# EAGLE schematic scoutfly_rev3 (EAGLE 6.3)
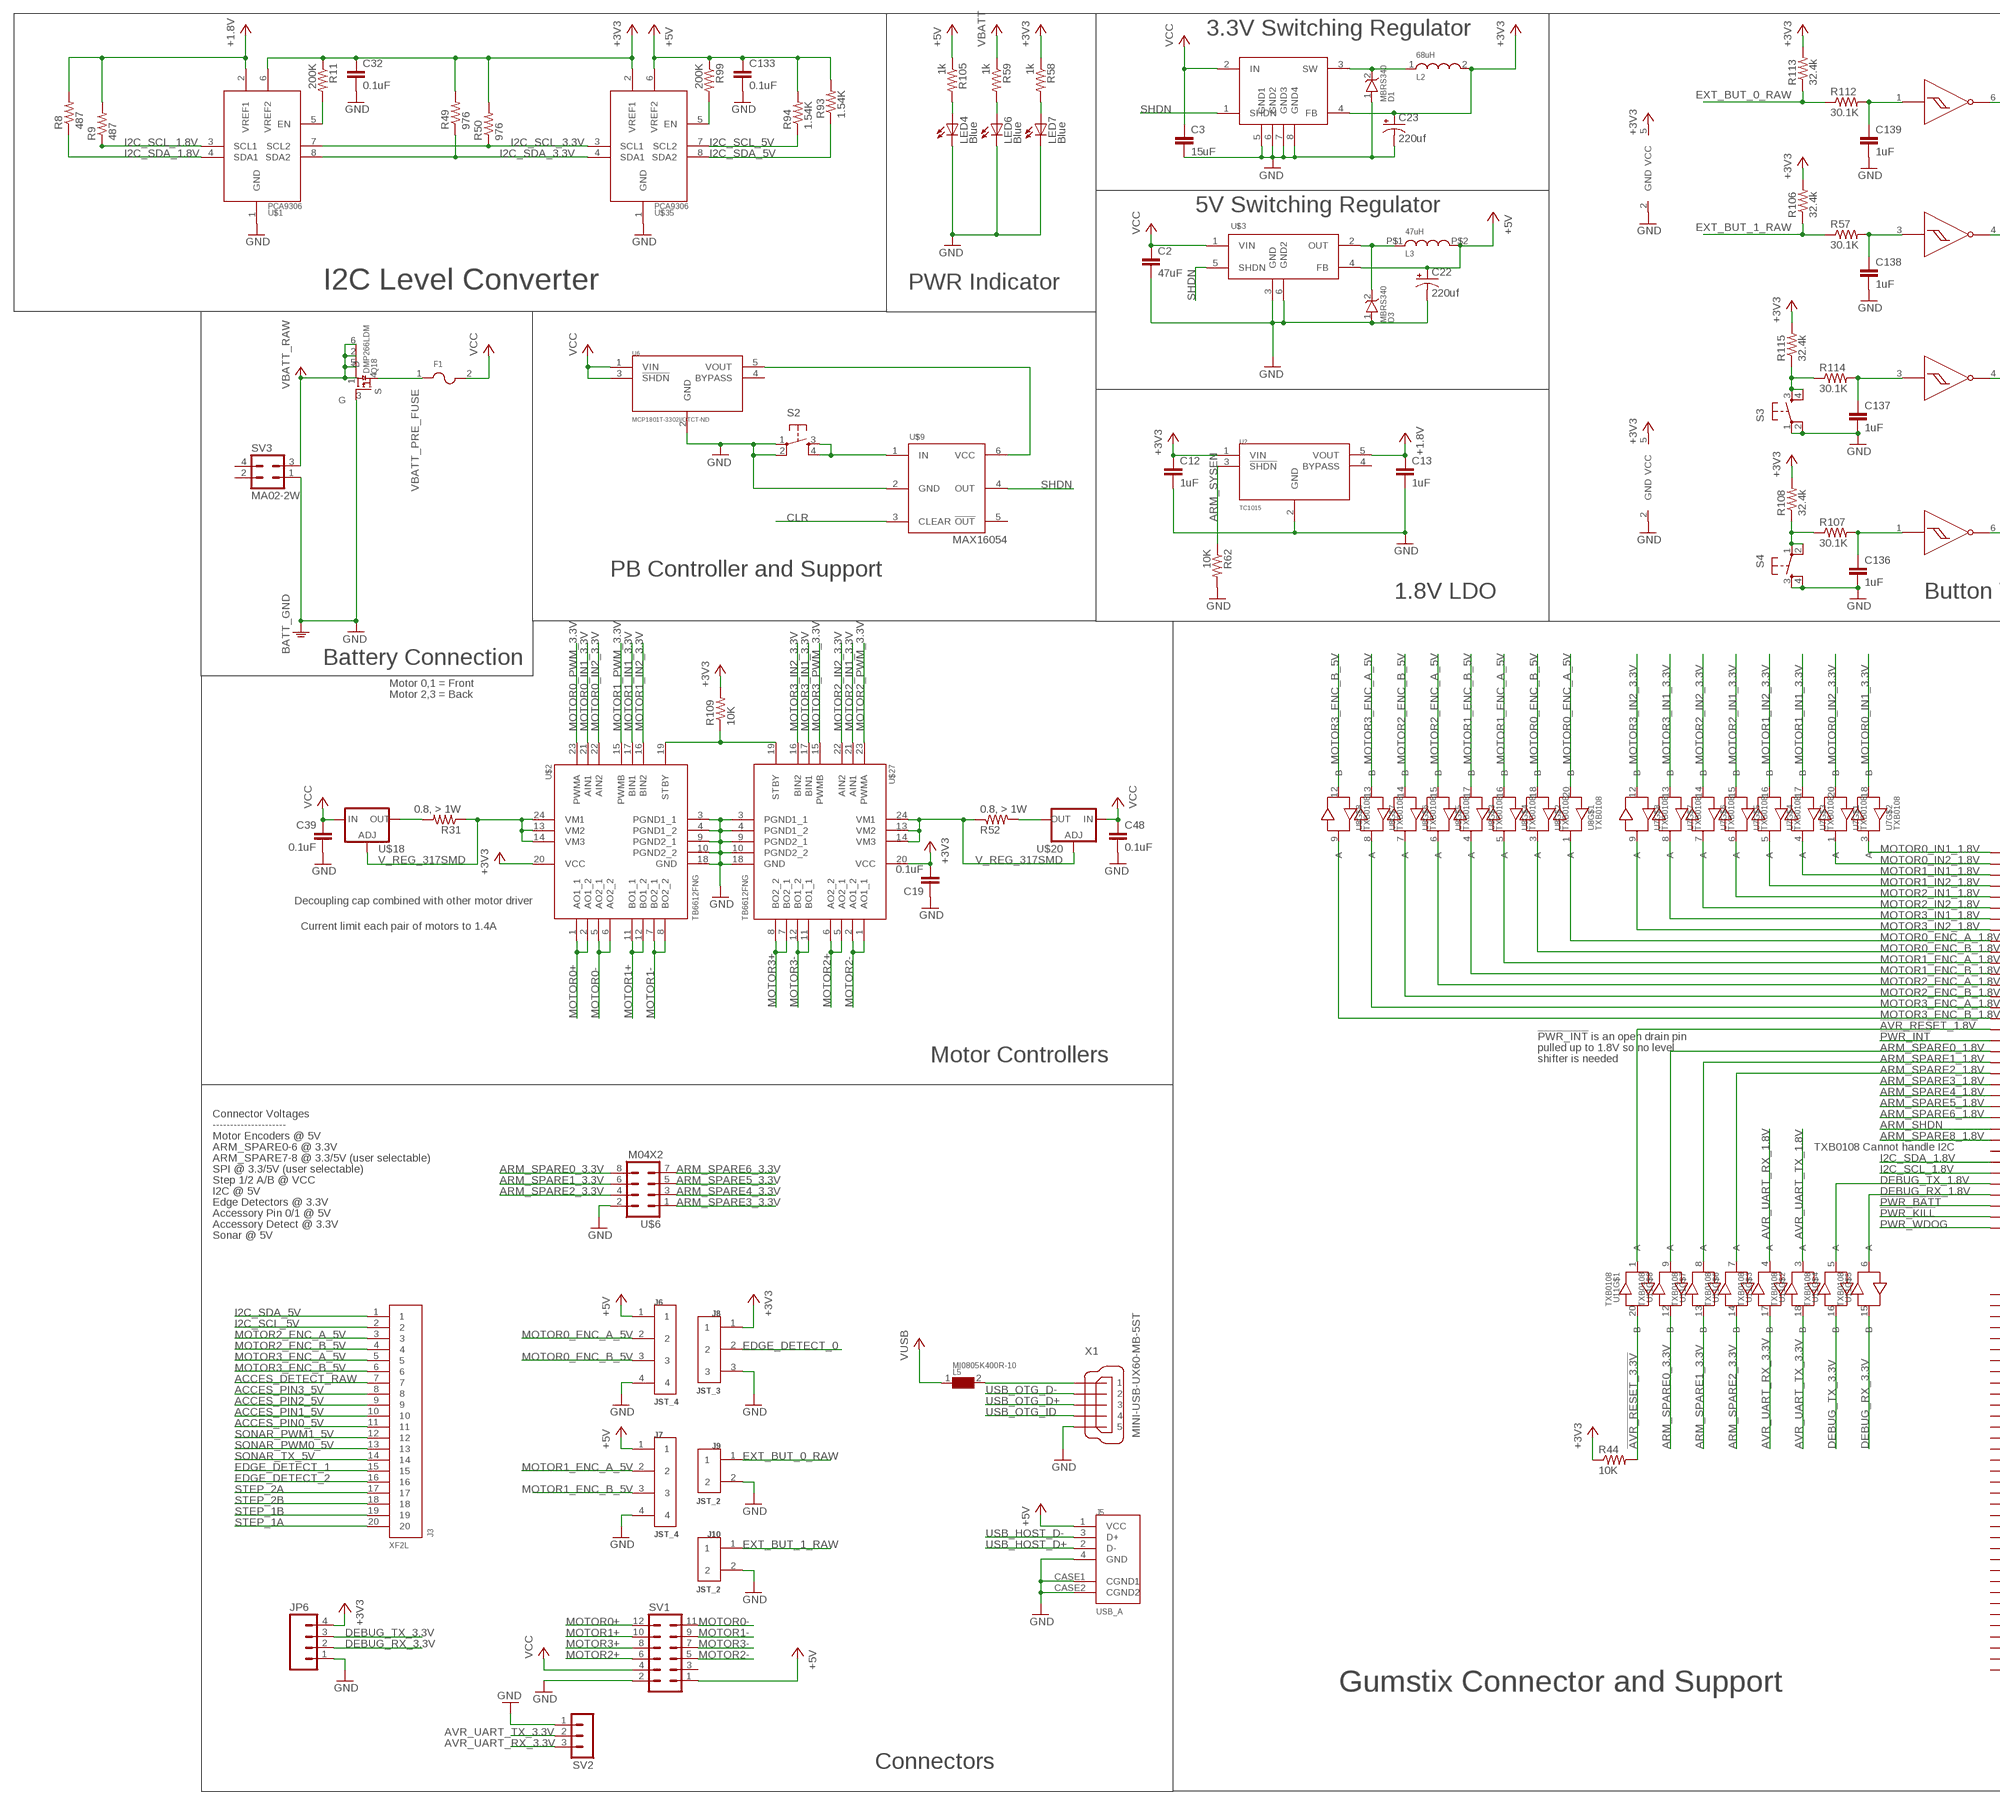
[diagram p0: schematic, sheet 1, part 1 of 3]
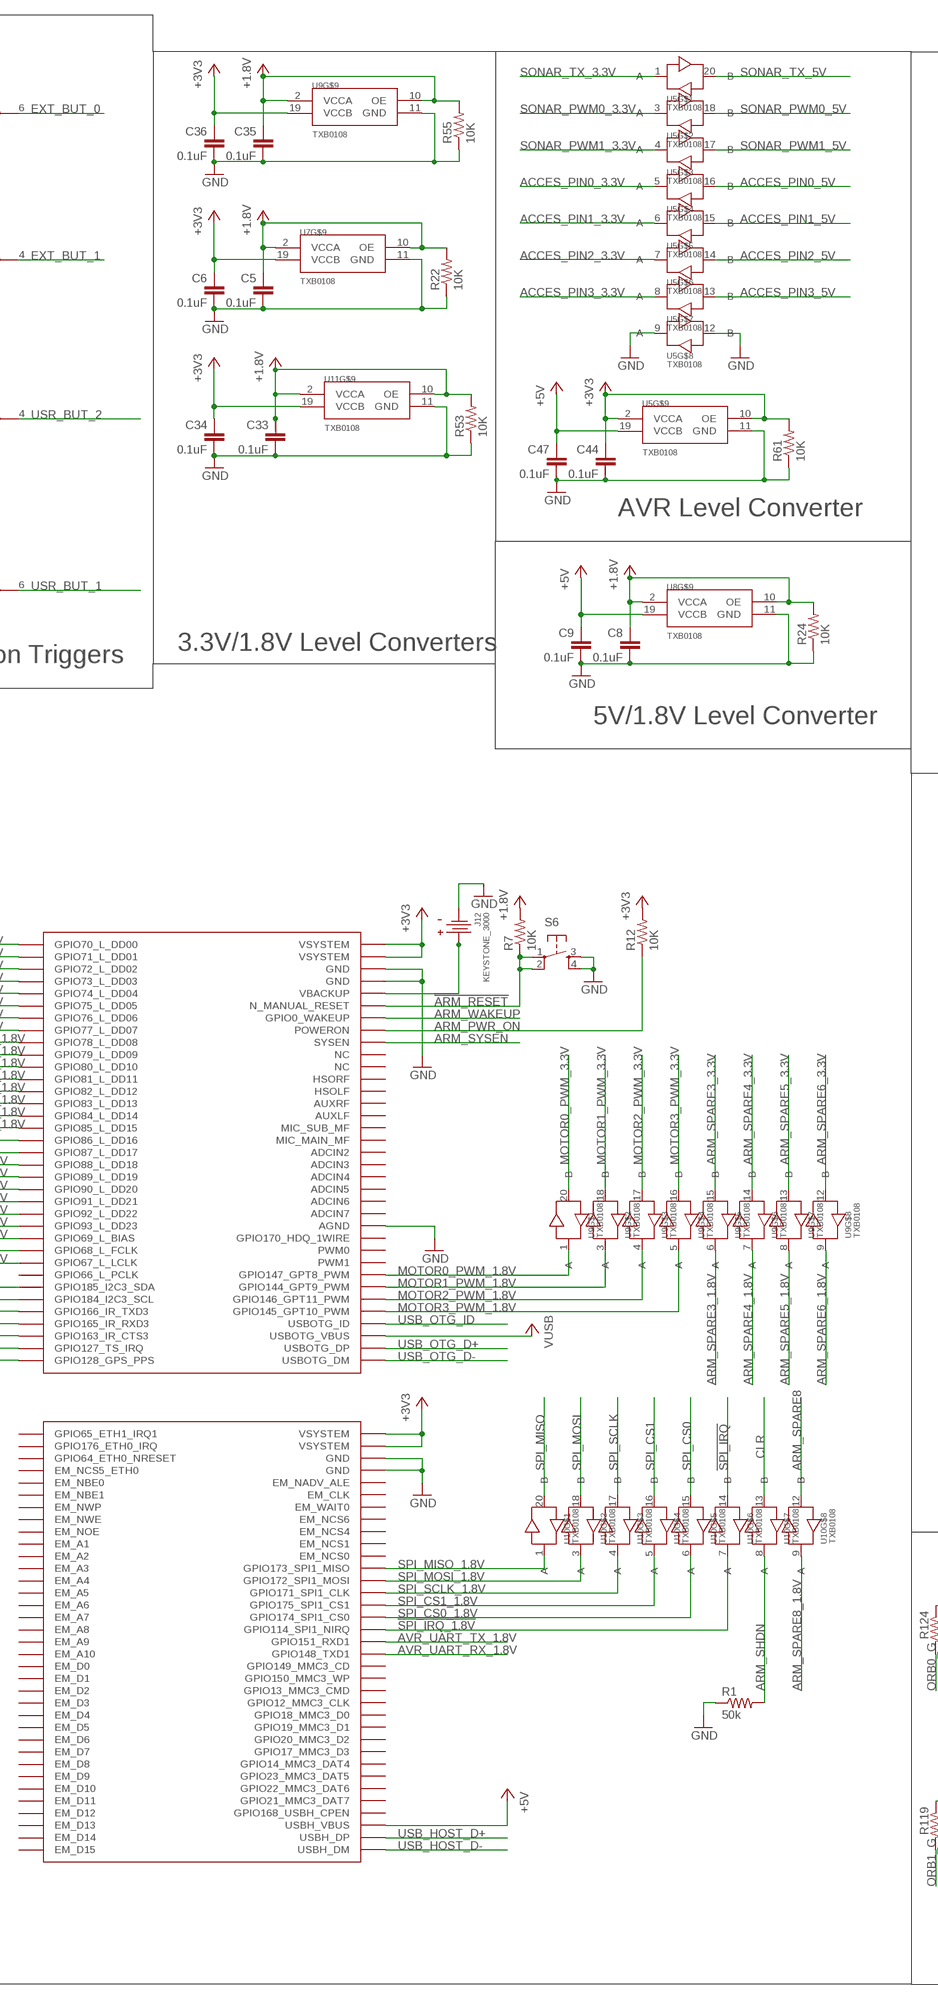
[diagram p1: schematic, sheet 1, part 2 of 3]
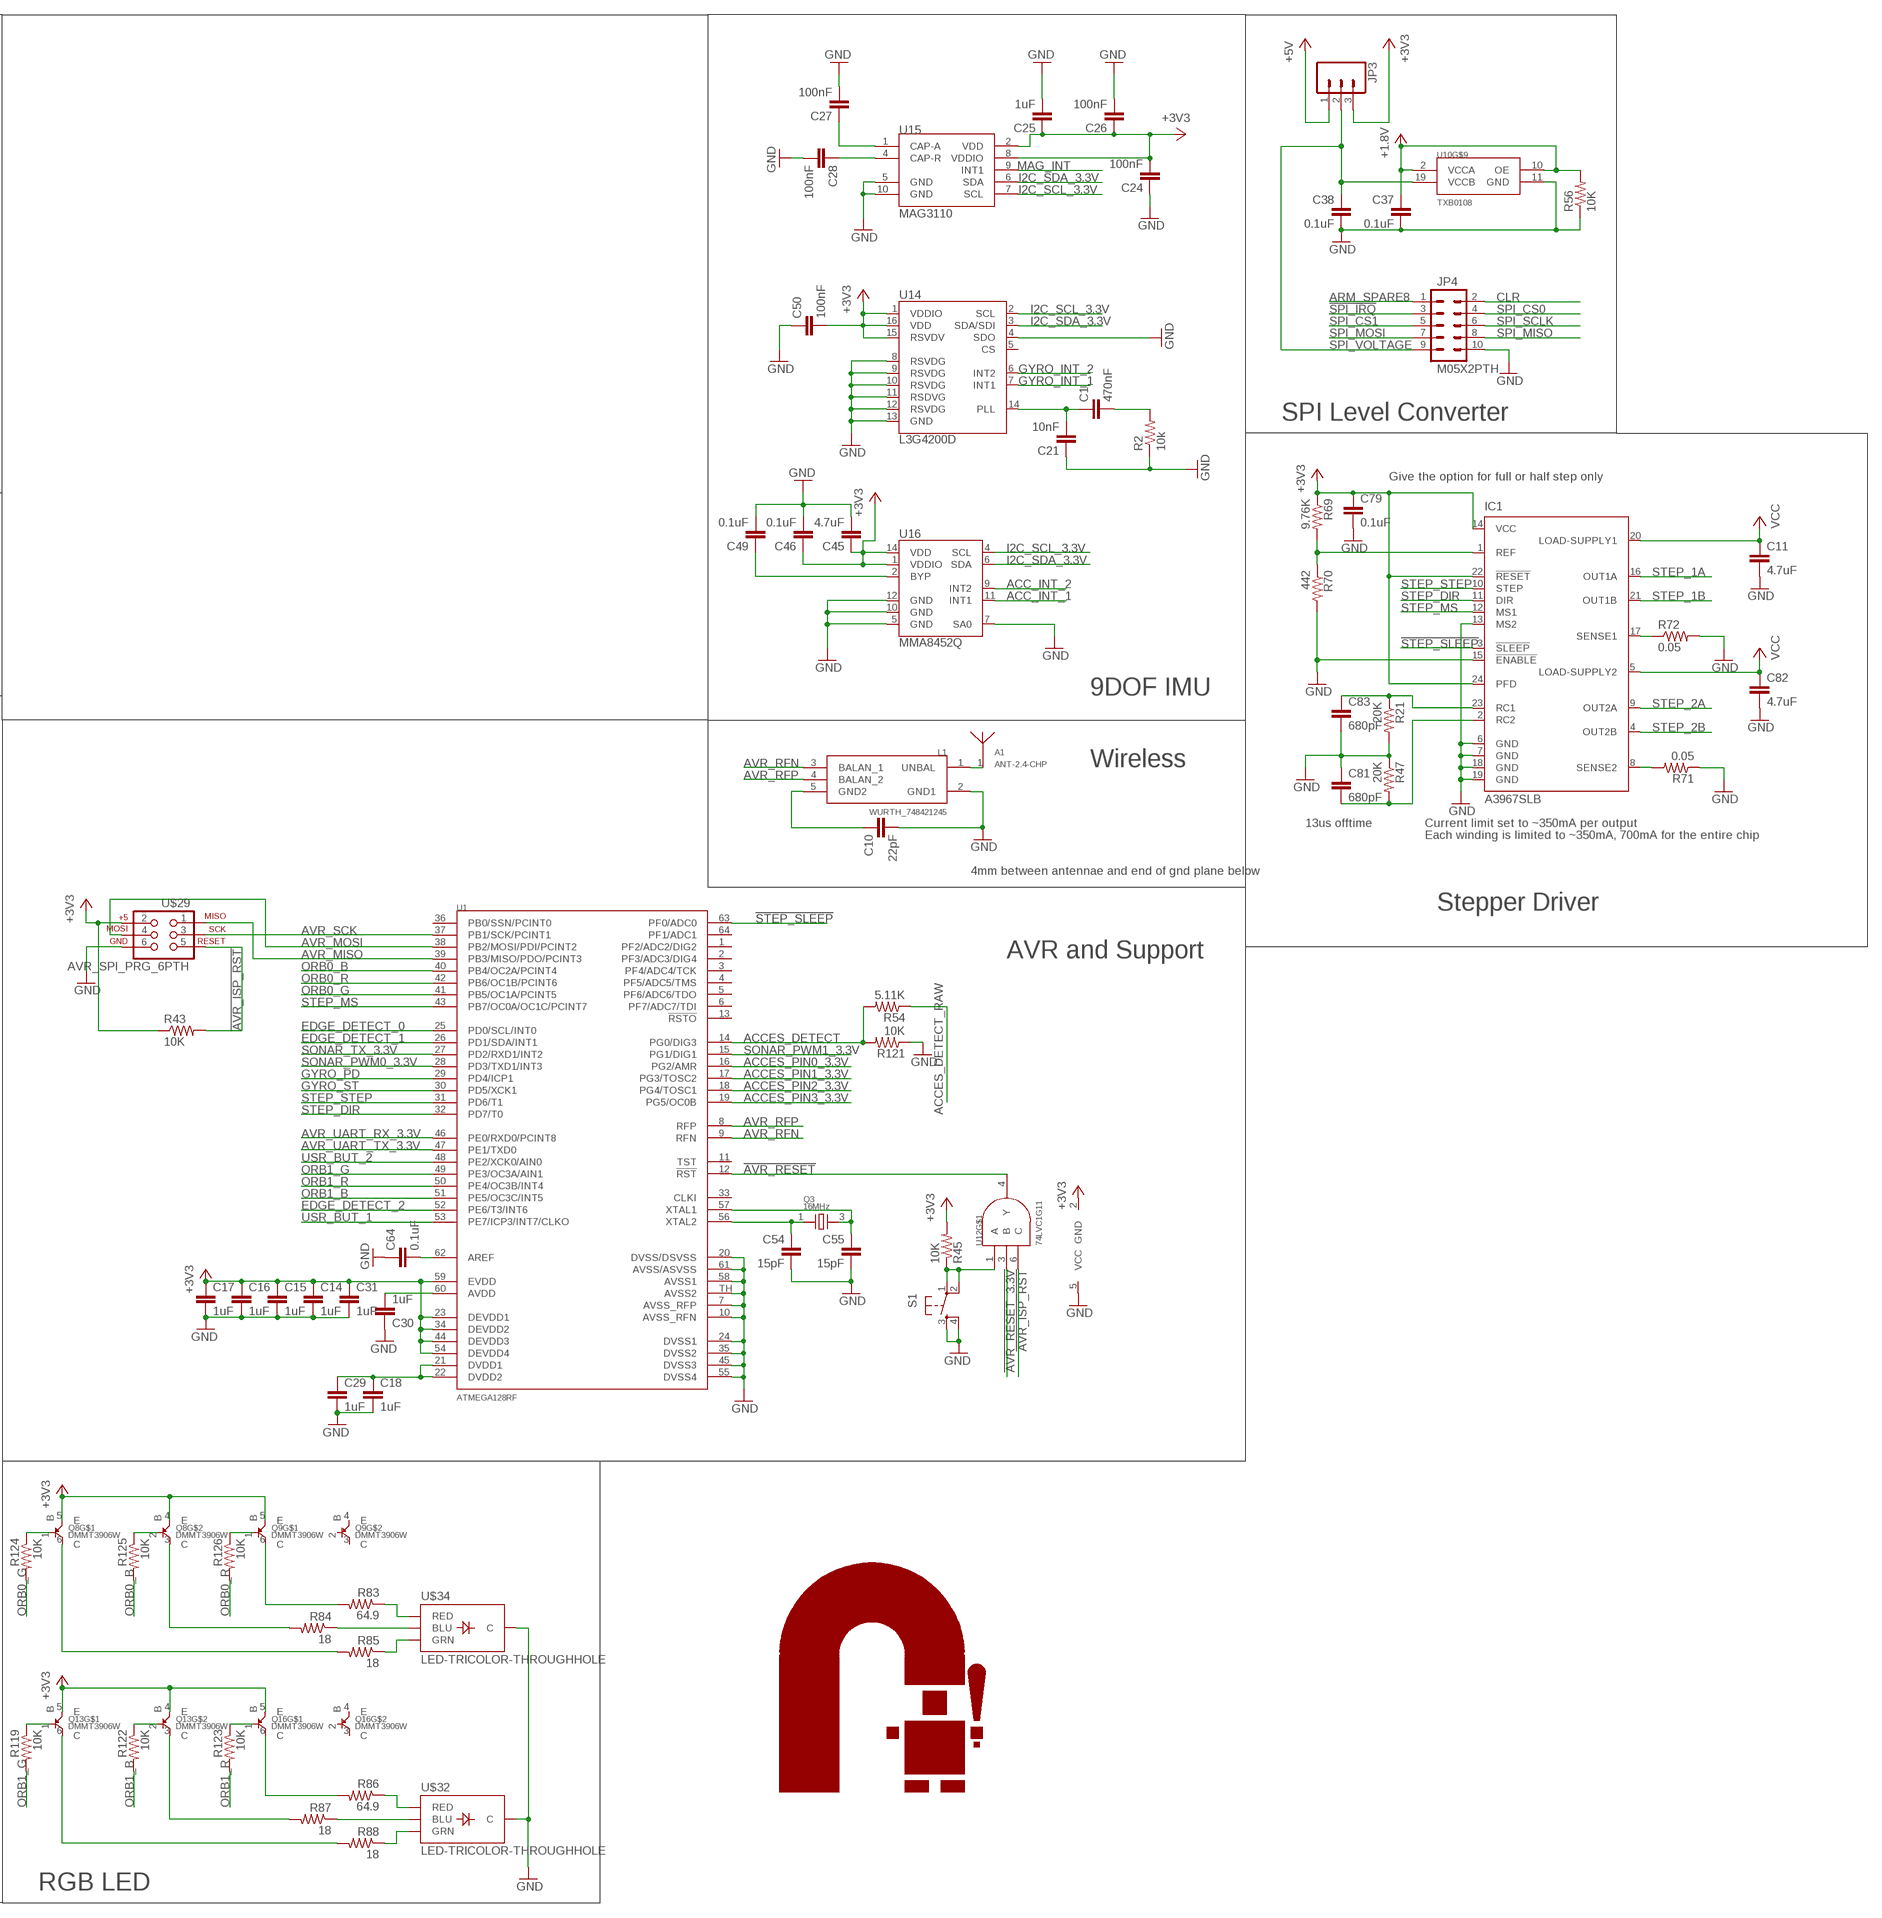
[diagram p2: schematic, sheet 1, part 3 of 3]

## Parts
A1  ANT-2.4-CHP  [CHIP_ANT_2.4GHZ]
C1  470nF  CAP0603-CAP  [0603-CAP]
C2  47uF  CAP0805  [0805]
C3  15uF  CAP0603-CAP  [0603-CAP]
C5  0.1uF  CAP0603-CAP  [0603-CAP]
C6  0.1uF  CAP0603-CAP  [0603-CAP]
C8  0.1uF  CAP0603-CAP  [0603-CAP]
C9  0.1uF  CAP0603-CAP  [0603-CAP]
C10  22pF  CAP0603-CAP  [0603-CAP]
C11  4.7uF  C-EUC0805  [C0805]
C12  1uF  CAP0603-CAP  [0603-CAP]
C13  1uF  CAP0603-CAP  [0603-CAP]
C14  1uF  CAP0603-CAP  [0603-CAP]
C15  1uF  CAP0603-CAP  [0603-CAP]
C16  1uF  CAP0603-CAP  [0603-CAP]
C17  1uF  CAP0603-CAP  [0603-CAP]
C18  1uF  CAP0603-CAP  [0603-CAP]
C19  0.1uF  CAP0603-CAP  [0603-CAP]
C21  10nF  CAP0603-CAP  [0603-CAP]
C22  220uf  CPOL-USCT6032  [CT6032]
C23  220uf  CPOL-USCT6032  [CT6032]
C24  100nF  CAP0603-CAP  [0603-CAP]
C25  1uF  CAP0603-CAP  [0603-CAP]
C26  100nF  CAP0603-CAP  [0603-CAP]
C27  100nF  CAP0603-CAP  [0603-CAP]
C28  100nF  CAP0603-CAP  [0603-CAP]
C29  1uF  CAP0603-CAP  [0603-CAP]
C30  1uF  CAP0603-CAP  [0603-CAP]
C31  1uF  CAP0603-CAP  [0603-CAP]
C32  0.1uF  CAP0603-CAP  [0603-CAP]
C33  0.1uF  CAP0603-CAP  [0603-CAP]
C34  0.1uF  CAP0603-CAP  [0603-CAP]
C35  0.1uF  CAP0603-CAP  [0603-CAP]
C36  0.1uF  CAP0603-CAP  [0603-CAP]
C37  0.1uF  CAP0603-CAP  [0603-CAP]
C38  0.1uF  CAP0603-CAP  [0603-CAP]
C39  0.1uF  CAP0603-CAP  [0603-CAP]
C44  0.1uF  CAP0603-CAP  [0603-CAP]
C45  4.7uF  CAP0603-CAP  [0603-CAP]
C46  0.1uF  CAP0603-CAP  [0603-CAP]
C47  0.1uF  CAP0603-CAP  [0603-CAP]
C48  0.1uF  CAP0603-CAP  [0603-CAP]
C49  0.1uF  CAP0603-CAP  [0603-CAP]
C50  100nF  CAP0603-CAP  [0603-CAP]
C54  15pF  CAP0603-CAP  [0603-CAP]
C55  15pF  CAP0603-CAP  [0603-CAP]
C64  0.1uF  CAP0603-CAP  [0603-CAP]
C79  0.1uF  CAP0603-CAP  [0603-CAP]
C81  680pF  CAP0603-CAP  [0603-CAP]
C82  4.7uF  C-EUC0805  [C0805]
C83  680pF  CAP0603-CAP  [0603-CAP]
C133  0.1uF  CAP0603-CAP  [0603-CAP]
C136  1uF  CAP0603-CAP  [0603-CAP]
C137  1uF  CAP0603-CAP  [0603-CAP]
C138  1uF  CAP0603-CAP  [0603-CAP]
C139  1uF  CAP0603-CAP  [0603-CAP]
D1  MBRS340  [SMC/DO-214AB]
D3  MBRS340  [SMC/DO-214AB]
F1  MF-SM200  [SM200]
IC1  A3967SLB  [SO24W]
J3  XF2L  [OMRON_XF]
J5  USB_A  [USB_A]
J6  JST_4  [JST_ZH_4]
J7  JST_4  [JST_ZH_4]
J8  JST_3  [JST_ZH_3]
J9  JST_2  [JST_ZH_2]
J10  JST_2  [JST_ZH_2]
J12  KEYSTONE_3000  [COIN_CELL]
JP3  M03PTH  [1X03]
JP4  M05X2PTH  [AVR_ICSP]
JP6  M04LOCK  [1X04_LOCK]
L1  WURTH_748421245  [WURTH_BALUN]
L2  68uH  NR6045TXXX  [NR6045]
L3  47uH  SRR1260-330MCT-ND  [0.492L0.492W0.236HINDUCTOR]
L5  MI0805K400R-10  [0805]
LED4  Blue  LED0603  [LED-0603]
LED6  Blue  LED0603  [LED-0603]
LED7  Blue  LED0603  [LED-0603]
Q3  16MHz  NX3225SA  [NX3225SA]
Q8  DMMT3906W  [SOT363]
Q9  DMMT3906W  [SOT363]
Q13  DMMT3906W  [SOT363]
Q16  DMMT3906W  [SOT363]
Q18  DMP266LDM  [SOT26]
R1  50k  R-US_R0603  [R0603]
R2  10k  R-US_R0603  [R0603]
R7  10K  R-US_R0603  [R0603]
R8  487  R-US_R0603  [R0603]
R9  487  R-US_R0603  [R0603]
R11  200K  R-US_R0603  [R0603]
R12  10K  R-US_R0603  [R0603]
R21  20K  R-US_R0603  [R0603]
R22  10K  R-US_R0603  [R0603]
R24  10K  R-US_R0603  [R0603]
R31  0.8, > 1W  R-US_R2512  [R2512]
R43  10K  R-US_R0603  [R0603]
R44  10K  R-US_R0603  [R0603]
R45  10K  R-US_R0603  [R0603]
R47  20K  R-US_R0603  [R0603]
R49  976  R-US_R0603  [R0603]
R50  976  R-US_R0603  [R0603]
R52  0.8, > 1W  R-US_R2512  [R2512]
R53  10K  R-US_R0603  [R0603]
R54  5.11K  R-US_R0603  [R0603]
R55  10K  R-US_R0603  [R0603]
R56  10K  R-US_R0603  [R0603]
R57  30.1K  R-US_R0603  [R0603]
R58  1k  R-US_R0603  [R0603]
R59  1k  R-US_R0603  [R0603]
R61  10K  R-US_R0603  [R0603]
R62  10K  R-US_R0603  [R0603]
R69  9.76K  R-US_R0603  [R0603]
R70  442  R-US_R0603  [R0603]
R71  0.05  R-US_R0603  [R0603]
R72  0.05  R-US_R0603  [R0603]
R83  64.9  R-US_R0603  [R0603]
R84  18  R-US_R0603  [R0603]
R85  18  R-US_R0603  [R0603]
R86  64.9  R-US_R0603  [R0603]
R87  18  R-US_R0603  [R0603]
R88  18  R-US_R0603  [R0603]
R93  1.54K  R-US_R0603  [R0603]
R94  1.54K  R-US_R0603  [R0603]
R99  200K  R-US_R0603  [R0603]
R105  1k  R-US_R0603  [R0603]
R106  32.4k  R-US_R0603  [R0603]
R107  30.1K  R-US_R0603  [R0603]
R108  32.4k  R-US_R0603  [R0603]
R109  10K  R-US_R0603  [R0603]
R112  30.1K  R-US_R0603  [R0603]
R113  32.4k  R-US_R0603  [R0603]
R114  30.1K  R-US_R0603  [R0603]
R115  32.4k  R-US_R0603  [R0603]
R119  10K  R-US_R0603  [R0603]
R121  10K  R-US_R0603  [R0603]
R122  10K  R-US_R0603  [R0603]
R123  10K  R-US_R0603  [R0603]
R124  10K  R-US_R0603  [R0603]
R125  10K  R-US_R0603  [R0603]
R126  10K  R-US_R0603  [R0603]
S1  TAC_SWITCHSMD  [TACTILE_SWITCH_SMD]
S2  TAC_SWITCHSMD  [TACTILE_SWITCH_SMD]
S3  TAC_SWITCHSMD  [TACTILE_SWITCH_SMD]
S4  TAC_SWITCHSMD  [TACTILE_SWITCH_SMD]
S6  TAC_SWITCHSMD  [TACTILE_SWITCH_SMD]
SV1  MA06-2W  [MA06-2W]
SV2  MA03-1  [MA03-1]
SV3  MA02-2W  [MA02-2W]
U1  ATMEGA128RF  [MLF64-TH]
U2  TC1015  [5-SOT23]
U3  NL27WZ14  [SOT363]
U4  NL27WZ14  [SOT363]
U5  TXB0108  [20-TSSOP]
U6  MCP1801T-3302I/OTCT-ND  TC1015  [5-SOT23]
U7  TXB0108  [20-TSSOP]
U8  TXB0108  [20-TSSOP]
U9  TXB0108  [20-TSSOP]
U10  TXB0108  [20-TSSOP]
U11  TXB0108  [20-TSSOP]
U12  74LVC1G11  [6-SOT23]
U14  L3G4200D  [LGA16-4X4]
U15  MAG3110  [DFN-10]
U16  MMA8452Q  [QFN-16_0.5MM]
U$1  PCA9306  [TSSOP8]
U$2  TB6612FNG  [24-SSOP]
U$3  AP1501  [DD2PAK]
U$6  M04X2  [2X4]
U$7  ROBOLOGOSILKSCREEN  [RCLOGO]
U$9  MAX16054  [6-TSOT23]
U$10  MIC4680-3.3YM  [8-SOIC]
U$16  OVERO  [OVERO]
U$18  V_REG_317SMD  [SOT223]
U$20  V_REG_317SMD  [SOT223]
U$27  TB6612FNG  [24-SSOP]
U$29  AVR_SPI_PRG_6PTH  [2X3]
U$32  LED-TRICOLOR-THROUGHHOLE  [LED-TRICOLOR-THROUGHHOLE]
U$34  LED-TRICOLOR-THROUGHHOLE  [LED-TRICOLOR-THROUGHHOLE]
U$35  PCA9306  [TSSOP8]
X1  MINI-USB-UX60-MB-5ST  [UX60-MB-5ST]

## Nets
!ARM_RESET: R7.1 S6.1 S6.2 U$16.N_MANUAL_RESET
!AVR_ISP_RST: R43.2 U12.6(C) U$29.5
!AVR_RESET: U1.12(!RST) U12.4(Y)
!AVR_RESET_1.8V: U11.1(A) U$16.GPIO86_L_DD16
!AVR_RESET_3.3V: R44.2 U11.20(B) U12.3(B)
!PWR_BATT: U$16.GPIO163_IR_CTS3
!PWR_INT: U$16.GPIO87_L_DD17
!PWR_KILL: U$16.GPIO127_TS_IRQ
!SPI_IRQ: JP4.3 U10.14(B)
!SPI_IRQ_1.8V: U10.7(A) U$16.GPIO114_SPI1_NIRQ
!STEP_SLEEP: IC1.3(!SLEEP) U1.63(PF0/ADC0)
+1.8V: C5.1 C8.1 C13.1 C33.1 C35.1 C37.1 R7.2 R8.2 R9.2 R22.2 R24.2 R53.2 R55.2 R56.2 U2.5(VOUT) U7.2(VCCA) U7.10(OE) U8.2(VCCA) U8.10(OE) U9.2(VCCA) U9.10(OE) U10.2(VCCA) U10.10(OE) U11.2(VCCA) U11.10(OE) U$1.2(VREF1)
+3V3: C6.1 C12.1 C14.1 C15.1 C16.1 C17.1 C19.2 C23.+ C24.2 C25.1 C26.1 C31.1 C32.1 C34.1 C36.1 C44.1 C45.1 C46.1 C50.2 C79.1 IC1.14(VCC) IC1.22(!RESET) IC1.24(PFD) J8.1 JP3.3 JP6.4 L2.2 Q8.4(E) Q8.5(E) Q9.5(E) Q13.4(E) Q13.5(E) Q16.5(E) R11.1 R12.2 R43.1 R44.1 R45.2 R49.2 R50.2 R58.1 R61.2 R69.1 R106.2 R108.2 R109.2 R113.2 R115.2 U1.23(DEVDD1) U1.34(DEVDD2) U1.44(DEVDD3) U1.54(DEVDD4) U1.59(EVDD) U2.1(VIN) U3.5(VCC) U4.5(VCC) U5.2(VCCA) U5.10(OE) U7.19(VCCB) U9.19(VCCB) U11.19(VCCB) U12.2(GND) U14.1(VDDIO) U14.15(RSVDV) U14.16(VDD) U15.2(VDD) U15.8(VDDIO) U16.1(VDDIO) U16.14(VDD) U$1.6(VREF2) U$2.20(VCC) U$10.4(FB) U$16.VSYSTEM@1(VSYSTEM) U$16.VSYSTEM@2(VSYSTEM) U$16.VSYSTEM@66(VSYSTEM) U$16.VSYSTEM@67(VSYSTEM) U$27.20(VCC) U$29.2 U$35.2(VREF1)
+5V: C9.1 C22.+ C47.1 C133.1 J5.1(VCC) J6.1 J7.1 JP3.1 L3.P$2 R93.2 R94.2 R99.1 R105.1 SV1.1 U5.19(VCCB) U8.19(VCCB) U$3.4(FB) U$16.USBH_VBUS U$35.6(VREF2)
ACC_INT_1: U16.11(INT1)
ACC_INT_2: U16.9(INT2)
ACCES_DETECT: R54.2 R121.2 U1.14(PG0/DIG3)
ACCES_DETECT_RAW: J3.7 R54.1
ACCES_PIN0_3.3V: U1.16(PG2/AMR) U5.5(A)
ACCES_PIN0_5V: J3.11 U5.16(B)
ACCES_PIN1_3.3V: U1.17(PG3/TOSC2) U5.6(A)
ACCES_PIN1_5V: J3.10 U5.15(B)
ACCES_PIN2_3.3V: U1.18(PG4/TOSC1) U5.7(A)
ACCES_PIN2_5V: J3.9 U5.14(B)
ACCES_PIN3_3.3V: U1.19(PG5/OC0B) U5.8(A)
ACCES_PIN3_5V: J3.8 U5.13(B)
ARM_PWR_ON: R12.1 U$16.POWERON
ARM_SHDN: R1.2 U10.8(A) U$16.GPIO68_L_FCLK
ARM_SPARE0_1.8V: U11.9(A) U$16.GPIO88_L_DD18
ARM_SPARE0_3.3V: U11.12(B) U$6.8
ARM_SPARE1_1.8V: U11.8(A) U$16.GPIO89_L_DD19
ARM_SPARE1_3.3V: U11.13(B) U$6.6
ARM_SPARE2_1.8V: U11.7(A) U$16.GPIO90_L_DD20
ARM_SPARE2_3.3V: U11.14(B) U$6.4
ARM_SPARE3_1.8V: U9.6(A) U$16.GPIO91_L_DD21
ARM_SPARE3_3.3V: U9.15(B) U$6.1
ARM_SPARE4_1.8V: U9.7(A) U$16.GPIO92_L_DD22
ARM_SPARE4_3.3V: U9.14(B) U$6.3
ARM_SPARE5_1.8V: U9.8(A) U$16.GPIO93_L_DD23
ARM_SPARE5_3.3V: U9.13(B) U$6.5
ARM_SPARE6_1.8V: U9.9(A) U$16.GPIO69_L_BIAS
ARM_SPARE6_3.3V: U9.12(B) U$6.7
ARM_SPARE8: JP4.1 U10.12(B)
ARM_SPARE8_1.8V: U10.9(A) U$16.GPIO67_L_LCLK
ARM_SYSEN: R62.1 U2.3(!SHDN) U$16.SYSEN
ARM_WAKEUP: U$16.GPIO0_WAKEUP
AVR_MISO: U1.39(PB3/MISO/PDO/PCINT3) U$29.1
AVR_MOSI: U1.38(PB2/MOSI/PDI/PCINT2) U$29.4
AVR_RFN: L1.3(BALAN_1) U1.9(RFN)
AVR_RFP: L1.4(BALAN_2) U1.8(RFP)
AVR_SCK: U1.37(PB1/SCK/PCINT1) U$29.3
AVR_UART_RX_1.8V: U11.4(A) U$16.GPIO148_TXD1
AVR_UART_RX_3.3V: SV2.3 U1.46(PE0/RXD0/PCINT8) U11.17(B)
AVR_UART_TX_1.8V: U11.3(A) U$16.GPIO151_RXD1
AVR_UART_TX_3.3V: SV2.2 U1.47(PE1/TXD0) U11.18(B)
CLR: JP4.2 U10.13(B) U$9.3(CLEAR)
DEBUG_RX_1.8V: U11.6(A) U$16.GPIO165_IR_RXD3
DEBUG_RX_3.3V: JP6.2 U11.15(B)
DEBUG_TX_1.8V: U11.5(A) U$16.GPIO166_IR_TXD3
DEBUG_TX_3.3V: JP6.3 U11.16(B)
EDGE_DETECT_0: J8.2 U1.25(PD0/SCL/INT0)
EDGE_DETECT_1: J3.15 U1.26(PD1/SDA/INT1)
EDGE_DETECT_2: J3.16 U1.52(PE6/T3/INT6)
EXT_BUT_0: U3.6(Y)
EXT_BUT_0_RAW: J9.1 R112.1 R113.1
EXT_BUT_1: U3.4(Y)
EXT_BUT_1_RAW: J10.1 R57.1 R106.1
GND: C2.2 C3.2 C5.2 C6.2 C8.2 C9.2 C10.2 C11.2 C12.2 C13.2 C14.2 C15.2 C16.2 C17.2 C18.2 C19.1 C21.1 C22.- C23.- C24.1 C25.2 C26.2 C27.2 C28.2 C29.2 C30.1 C31.2 C32.2 C33.2 C34.2 C35.2 C36.2 C37.2 C38.2 C39.2 C44.2 C45.2 C46.2 C47.2 C48.2 C49.2 C50.1 C54.2 C55.2 C64.1 C79.2 C81.1 C82.2 C83.2 C133.2 C136.2 C137.2 C138.2 C139.2 D1.1 D3.1 IC1.6(GND) IC1.7(GND) IC1.13(MS2) IC1.15(!ENABLE) IC1.18(GND) IC1.19(GND) J5.4(GND) J5.CASE1(CGND1) J5.CASE2(CGND2) J6.4 J7.4 J8.3 J9.2 J10.2 J12.NEGATIVE(-) JP4.10 JP6.1 L1.2(GND1) LED4.C LED6.C LED7.C Q18.3(G) R1.1 R2.1 R21.2 R22.1 R24.1 R47.1 R53.1 R55.1 R56.1 R61.1 R62.2 R70.2 R71.1 R72.2 R121.1 S1.3 S1.4 S2.1 S2.2 S3.1 S3.2 S4.3 S4.4 S6.3 S6.4 SV1.2 SV2.1 SV3.1 U1.7(AVSS_RFP) U1.10(AVSS_RFN) U1.20(DVSS/DSVSS) U1.24(DVSS1) U1.35(DVSS2) U1.45(DVSS3) U1.55(DVSS4) U1.58(AVSS1) U1.61(AVSS/ASVSS) U1.TH(AVSS2) U2.2(GND) U3.2(GND) U4.2(GND) U5.9(A) U5.11(GND) U5.12(B) U6.2(GND) U7.11(GND) U8.11(GND) U9.11(GND) U10.11(GND) U11.11(GND) U12.5(VCC) U14.4(SDO) U14.8(RSVDG) U14.9(RSVDG) U14.10(RSVDG) U14.11(RSDVG) U14.12(RSVDG) U14.13(GND) U15.5(GND) U15.10(GND) U16.5(GND) U16.7(SA0) U16.10(GND) U16.12(GND) U$1.1(GND) U$2.3(PGND1_1) U$2.4(PGND1_2) U$2.9(PGND2_1) U$2.10(PGND2_2) U$2.18(GND) U$3.3(GND) U$3.6(GND2) U$6.2 U$9.2(GND) U$10.5(GND1) U$10.6(GND2) U$10.7(GND3) U$10.8(GND4) U$16.AGND U$16.GND U$16.GND@33(GND) U$16.GND@56(GND) U$16.GND@70(GND) U$27.3(PGND1_1) U$27.4(PGND1_2) U$27.9(PGND2_1) U$27.10(PGND2_2) U$27.18(GND) U$29.6 U$32.GND(C) U$34.GND(C) U$35.1(GND) X1.5 ; supply symbol labelled BATT_GND
GYRO_INT_1: U14.7(INT1)
GYRO_INT_2: U14.6(INT2)
GYRO_PD: U1.29(PD4/ICP1)
GYRO_ST: U1.30(PD5/XCK1)
I2C_SCL_1.8V: R9.1 U$1.3(SCL1) U$16.GPIO184_I2C3_SCL
I2C_SCL_3.3V: R50.1 U14.2(SCL) U15.7(SCL) U16.4(SCL) U$1.7(SCL2) U$35.3(SCL1)
I2C_SCL_5V: J3.2 R94.1 U$35.7(SCL2)
I2C_SDA_1.8V: R8.1 U$1.4(SDA1) U$16.GPIO185_I2C3_SDA
I2C_SDA_3.3V: R49.1 U14.3(SDA/SDI) U15.6(SDA) U16.6(SDA) U$1.8(SDA2) U$35.4(SDA1)
I2C_SDA_5V: J3.1 R93.1 U$35.8(SDA2)
MAG_INT: U15.9(INT1)
MOTOR0+: SV1.12 U$2.1(AO1_1) U$2.2(AO1_2)
MOTOR0-: SV1.11 U$2.5(AO2_1) U$2.6(AO2_2)
MOTOR0_ENC_A_1.8V: U8.1(A) U$16.GPIO78_L_DD08
MOTOR0_ENC_A_5V: J6.2 U8.20(B)
MOTOR0_ENC_B_1.8V: U8.3(A) U$16.GPIO79_L_DD09
MOTOR0_ENC_B_5V: J6.3 U8.18(B)
MOTOR0_IN1_1.8V: U7.3(A) U$16.GPIO70_L_DD00
MOTOR0_IN1_3.3V: U7.18(B) U$2.21(AIN1)
MOTOR0_IN2_1.8V: U7.1(A) U$16.GPIO71_L_DD01
MOTOR0_IN2_3.3V: U7.20(B) U$2.22(AIN2)
MOTOR0_PWM_1.8V: U9.1(A) U$16.GPIO147_GPT8_PWM
MOTOR0_PWM_3.3V: U9.20(B) U$2.23(PWMA)
MOTOR1+: SV1.10 U$2.11(BO1_1) U$2.12(BO1_2)
MOTOR1-: SV1.9 U$2.7(BO2_1) U$2.8(BO2_2)
MOTOR1_ENC_A_1.8V: U8.5(A) U$16.GPIO80_L_DD10
MOTOR1_ENC_A_5V: J7.2 U8.16(B)
MOTOR1_ENC_B_1.8V: U8.4(A) U$16.GPIO81_L_DD11
MOTOR1_ENC_B_5V: J7.3 U8.17(B)
MOTOR1_IN1_1.8V: U7.4(A) U$16.GPIO72_L_DD02
MOTOR1_IN1_3.3V: U7.17(B) U$2.17(BIN1)
MOTOR1_IN2_1.8V: U7.5(A) U$16.GPIO73_L_DD03
MOTOR1_IN2_3.3V: U7.16(B) U$2.16(BIN2)
MOTOR1_PWM_1.8V: U9.3(A) U$16.GPIO144_GPT9_PWM
MOTOR1_PWM_3.3V: U9.18(B) U$2.15(PWMB)
MOTOR2+: SV1.6 U$27.5(AO2_1) U$27.6(AO2_2)
MOTOR2-: SV1.5 U$27.1(AO1_1) U$27.2(AO1_2)
MOTOR2_ENC_A_1.8V: U8.6(A) U$16.GPIO82_L_DD12
MOTOR2_ENC_A_5V: J3.3 U8.15(B)
MOTOR2_ENC_B_1.8V: U8.7(A) U$16.GPIO83_L_DD13
MOTOR2_ENC_B_5V: J3.4 U8.14(B)
MOTOR2_IN1_1.8V: U7.6(A) U$16.GPIO74_L_DD04
MOTOR2_IN1_3.3V: U7.15(B) U$27.21(AIN1)
MOTOR2_IN2_1.8V: U7.7(A) U$16.GPIO75_L_DD05
MOTOR2_IN2_3.3V: U7.14(B) U$27.22(AIN2)
MOTOR2_PWM_1.8V: U9.4(A) U$16.GPIO146_GPT11_PWM
MOTOR2_PWM_3.3V: U9.17(B) U$27.23(PWMA)
MOTOR3+: SV1.8 U$27.7(BO2_1) U$27.8(BO2_2)
MOTOR3-: SV1.7 U$27.11(BO1_1) U$27.12(BO1_2)
MOTOR3_ENC_A_1.8V: U8.8(A) U$16.GPIO84_L_DD14
MOTOR3_ENC_A_5V: J3.5 U8.13(B)
MOTOR3_ENC_B_1.8V: U8.9(A) U$16.GPIO85_L_DD15
MOTOR3_ENC_B_5V: J3.6 U8.12(B)
MOTOR3_IN1_1.8V: U7.8(A) U$16.GPIO76_L_DD06
MOTOR3_IN1_3.3V: U7.13(B) U$27.17(BIN1)
MOTOR3_IN2_1.8V: U7.9(A) U$16.GPIO77_L_DD07
MOTOR3_IN2_3.3V: U7.12(B) U$27.16(BIN2)
MOTOR3_PWM_1.8V: U9.5(A) U$16.GPIO145_GPT10_PWM
MOTOR3_PWM_3.3V: U9.16(B) U$27.15(PWMB)
N$1: A1.1 L1.1(UNBAL)
N$2: R45.1 S1.1 S1.2 U12.1(A)
N$3: J12.PLUS1(+) J12.PLUS2(+2) U$16.VBACKUP
N$4: C83.1 IC1.23(RC1) R21.1
N$5: IC1.17(SENSE1) R72.1
N$6: IC1.8(SENSE2) R71.2
N$7: C81.2 IC1.2(RC2) R47.2
N$10: C10.1 L1.5(GND2)
N$11: Q8.1(B) R124.1
N$12: D1.2 L2.1 U$10.3(SW)
N$13: C30.2 U1.60(AVDD)
N$15: D3.2 L3.P$1 U$3.2(OUT)
N$17: C18.1 C29.1 U1.21(DVDD1) U1.22(DVDD2)
N$18: R11.2 U$1.5(EN)
N$23: C64.2 U1.62(AREF)
N$33: R31.1 U$2.13(VM2) U$2.14(VM3) U$2.24(VM1) U$18.1(ADJ)
N$34: R31.2 U$18.2(OUT)
N$35: R52.1 U$20.1(ADJ) U$27.13(VM2) U$27.14(VM3) U$27.24(VM1)
N$36: R52.2 U$20.2(OUT)
N$38: C1.1 C21.2 U14.14(PLL)
N$39: C1.2 R2.2
N$40: Q8.2(B) R125.1
N$41: Q9.1(B) R126.1
N$42: Q16.1(B) R123.1
N$43: Q13.2(B) R122.1
N$44: Q13.1(B) R119.1
N$46: S2.3 S2.4 U$9.1(IN)
N$47: U6.5(VOUT) U$9.6(VCC)
N$49: R85.1 U$34.GRN
N$50: C49.1 U16.2(BYP)
N$53: C27.1 U15.1(CAP-A)
N$54: C28.1 U15.4(CAP-R)
N$142: L5.2 X1.1
N$161: C55.1 Q3.3 U1.57(XTAL1)
N$162: C54.1 Q3.1 U1.56(XTAL2)
N$174: C138.1 R57.2 U3.3(X)
N$198: IC1.1(REF) R69.2 R70.1
N$206: R109.1 U$2.19(STBY) U$27.19(STBY)
N$225: R84.1 U$34.BLU
N$226: R83.1 U$34.RED
N$227: Q9.6(C) R83.2
N$228: Q8.3(C) R84.2
N$229: Q8.6(C) R85.2
N$231: R88.1 U$32.GRN
N$232: R87.1 U$32.BLU
N$233: R86.1 U$32.RED
N$234: Q16.6(C) R86.2
N$235: Q13.3(C) R87.2
N$236: Q13.6(C) R88.2
N$248: R99.2 U$35.5(EN)
N$262: LED4.A R105.2
N$264: LED6.A R59.2
N$265: LED7.A R58.2
N$274: C139.1 R112.2 U3.1(X)
N$275: C137.1 R114.2 U4.3(X)
N$276: C136.1 R107.2 U4.1(X)
N$277: R107.1 R108.1 S4.1 S4.2
N$278: R114.1 R115.1 S3.3 S3.4
ORB0_B: R125.2 U1.40(PB4/OC2A/PCINT4)
ORB0_G: R124.2 U1.41(PB5/OC1A/PCINT5)
ORB0_R: R126.2 U1.42(PB6/OC1B/PCINT6)
ORB1_B: R122.2 U1.51(PE5/OC3C/INT5)
ORB1_G: R119.2 U1.49(PE3/OC3A/AIN1)
ORB1_R: R123.2 U1.50(PE4/OC3B/INT4)
PWR_WDOG: U$16.GPIO128_GPS_PPS
SHDN: U$3.5(SHDN) U$9.4(OUT) U$10.1(SHDN)
SONAR_PWM0_3.3V: U1.28(PD3/TXD1/INT3) U5.3(A)
SONAR_PWM0_5V: J3.13 U5.18(B)
SONAR_PWM1_3.3V: U1.15(PG1/DIG1) U5.4(A)
SONAR_PWM1_5V: J3.12 U5.17(B)
SONAR_TX_3.3V: U1.27(PD2/RXD1/INT2) U5.1(A)
SONAR_TX_5V: J3.14 U5.20(B)
SPI_CS0: JP4.4 U10.15(B)
SPI_CS0_1.8V: U10.6(A) U$16.GPIO174_SPI1_CS0
SPI_CS1: JP4.5 U10.16(B)
SPI_CS1_1.8V: U10.5(A) U$16.GPIO175_SPI1_CS1
SPI_MISO: JP4.8 U10.20(B)
SPI_MISO_1.8V: U10.1(A) U$16.GPIO173_SPI1_MISO
SPI_MOSI: JP4.7 U10.18(B)
SPI_MOSI_1.8V: U10.3(A) U$16.GPIO172_SPI1_MOSI
SPI_SCLK: JP4.6 U10.17(B)
SPI_SCLK_1.8V: U10.4(A) U$16.GPIO171_SPI1_CLK
SPI_VOLTAGE: C38.1 JP3.2 JP4.9 U10.19(VCCB)
STEP_1A: IC1.16(OUT1A) J3.20
STEP_1B: IC1.21(OUT1B) J3.19
STEP_2A: IC1.9(OUT2A) J3.17
STEP_2B: IC1.4(OUT2B) J3.18
STEP_DIR: IC1.11(DIR) U1.32(PD7/T0)
STEP_MS: IC1.12(MS1) U1.43(PB7/OC0A/OC1C/PCINT7)
STEP_STEP: IC1.10(STEP) U1.31(PD6/T1)
USB_HOST_D+: J5.2(D-) U$16.USBH_DP
USB_HOST_D-: J5.3(D+) U$16.USBH_DM
USB_OTG_D+: U$16.USBOTG_DP X1.3
USB_OTG_D-: U$16.USBOTG_DM X1.2
USB_OTG_ID: U$16.USBOTG_ID X1.4
USR_BUT_1: U1.53(PE7/ICP3/INT7/CLKO) U4.6(Y)
USR_BUT_2: U1.48(PE2/XCK0/AIN0) U4.4(Y)
VBATT: R59.1
VBATT_PRE_FUSE: F1.1 Q18.4(S)
VBATT_RAW: Q18.1(D) Q18.2(D2) Q18.5(D3) Q18.6(D4) SV3.3
VCC: C2.1 C3.1 C11.1 C39.1 C48.1 C82.1 F1.2 IC1.5(LOAD-SUPPLY2) IC1.20(LOAD-SUPPLY1) SV1.4 U6.1(VIN) U6.3(!SHDN) U$3.1(VIN) U$10.2(IN) U$18.3(IN) U$20.3(IN)
VUSB: L5.1 U$16.USBOTG_VBUS
Unconnected: Q3.2(GND) Q3.4(GND1) Q9.2(B) Q9.3(C) Q9.4(E) Q16.2(B) Q16.3(C) Q16.4(E) SV1.3 SV3.2 SV3.4 U1.1(PF2/ADC2/DIG2) U1.2(PF3/ADC3/DIG4) U1.3(PF4/ADC4/TCK) U1.4(PF5/ADC5/TMS) U1.5(PF6/ADC6/TDO) U1.6(PF7/ADC7/TDI) U1.11(TST) U1.13(!RSTO) U1.33(CLKI) U1.36(PB0/SSN/PCINT0) U1.64(PF1/ADC1) U2.4(BYPASS) U6.4(BYPASS) U14.5(CS) U$9.5(!OUT) U$16.ADCIN2 U$16.ADCIN3 U$16.ADCIN4 U$16.ADCIN5 U$16.ADCIN6 U$16.ADCIN7 U$16.AUXLF U$16.AUXRF U$16.EM_A1 U$16.EM_A2 U$16.EM_A3 U$16.EM_A4 U$16.EM_A5 U$16.EM_A6 U$16.EM_A7 U$16.EM_A8 U$16.EM_A9 U$16.EM_A10 U$16.EM_CLK U$16.EM_D0 U$16.EM_D1 U$16.EM_D2 U$16.EM_D3 U$16.EM_D4 U$16.EM_D5 U$16.EM_D6 U$16.EM_D7 U$16.EM_D8 U$16.EM_D9 U$16.EM_D10 U$16.EM_D11 U$16.EM_D12 U$16.EM_D13 U$16.EM_D14 U$16.EM_D15 U$16.EM_NADV_ALE U$16.EM_NBE0 U$16.EM_NBE1 U$16.EM_NCS0 U$16.EM_NCS1 U$16.EM_NCS4 U$16.EM_NCS5_ETH0 U$16.EM_NCS6 U$16.EM_NOE U$16.EM_NWE U$16.EM_NWP U$16.EM_WAIT0 U$16.GPIO12_MMC3_CLK U$16.GPIO13_MMC3_CMD U$16.GPIO14_MMC3_DAT4 U$16.GPIO17_MMC3_D3 U$16.GPIO18_MMC3_D0 U$16.GPIO19_MMC3_D1 U$16.GPIO20_MMC3_D2 U$16.GPIO21_MMC3_DAT7 U$16.GPIO22_MMC3_DAT6 U$16.GPIO23_MMC3_DAT5 U$16.GPIO64_ETH0_NRESET U$16.GPIO65_ETH1_IRQ1 U$16.GPIO66_L_PCLK U$16.GPIO149_MMC3_CD U$16.GPIO150_MMC3_WP U$16.GPIO168_USBH_CPEN U$16.GPIO170_HDQ_1WIRE U$16.GPIO176_ETH0_IRQ U$16.HSOLF U$16.HSORF U$16.MIC_MAIN_MF U$16.MIC_SUB_MF U$16.NC@62(NC) U$16.NC@63(NC) U$16.PWM0 U$16.PWM1

## Notes on the sheet
- 3.3V Switching Regulator
- 5V Switching Regulator
- I2C Level Converter | PWR Indicator
- SPI Level Converter
- AVR Level Converter
- Give the option for full or half step only
- PB Controller and Support
- 3.3V/1.8V Level Converters
- 1.8V LDO | Button Triggers
- 5V/1.8V Level Converter
- Battery Connection
- 9DOF IMU
- Motor 0,1 = Front
- Motor 2,3 = Back
- Wireless
- 13us offtime | Current limit set to ~350mA per output
- Each winding is limited to ~350mA, 700mA for the entire chip
- 4mm between antennae and end of gnd plane below
- Stepper Driver
- Decoupling cap combined with other motor driver
- AVR and Support
- Current limit each pair of motors to 1.4A
- !PWR_INT! is an open drain pin
- pulled up to 1.8V so no level
- Motor Controllers | shifter is needed
- Connector Voltages
- ---------------------
- Motor Encoders @ 5V
- ARM_SPARE0-6 @ 3.3V | TXB0108 Cannot handle I2C
- ARM_SPARE7-8 @ 3.3/5V (user selectable)
- SPI @ 3.3/5V (user selectable)
- Step 1/2 A/B @ VCC
- I2C @ 5V
- Edge Detectors @ 3.3V
- Accessory Pin 0/1 @ 5V
- Accessory Detect @ 3.3V
- Sonar @ 5V
- Gumstix Connector and Support
- Connectors
- RGB LED

## Library data of the parts
A1 = kwoo:ANT-2.4-CHP
C1-C3 C5 C6 C8-C10 C12-C19 C21 C24-C39 C44-C50 C54 C55 C64 C79 C81 C83 C133 C136-C139 = SparkFun:CAP: Capacitor Standard 0603 ceramic capacitor, and 0.1" leaded capacitor.
C11 C82 = rcl:C-EU: CAPACITOR, European symbol
C22 C23 = rcl:CPOL-US: POLARIZED CAPACITOR, American symbol
D1 D3 = kwoo:MBRS340
F1 = kwoo:MF-SM200
IC1 = allegro:A3967SLB: MICROSTEPPING DRIVER WITH TRANSLATOR Source: 3967.pdf
J3 = kwoo:XF2L
J5 = kwoo:USB_A
J6 J7 = kwoo:JST_4
J8 = kwoo:JST_3
J9 J10 = kwoo:JST_2
J12 = kwoo:KEYSTONE_3000
JP3 = SparkFun:M03: Header 3 Standard 3-pin 0.1" header. Use with straight break away headers (SKU : PRT-00116), right angle break away headers (PRT-00553), swiss pins (PRT-00743), machine pins (PRT-00117), and female headers (PRT-00115). Molex polarized connector foot print use with SKU : PRT-08232 with associated crimp pins and housings.
JP4 = SparkFun:M05X2: Header 5x2 Standard 10-pin dual row 0.1" header. Commonly used with AVR-ISP. Use with Spark Fun Electronics SKU: PRT-00778
JP6 = SparkFun:M04: Header 4 Standard 4-pin 0.1" header. Use with straight break away headers (SKU : PRT-00116), right angle break away headers (PRT-00553), swiss pins (PRT-00743), machine pins (PRT-00117), and female headers (PRT-00115). Molex polarized connector foot print use with SKU : PRT-08231 with associated crimp pins and housings.
L1 = kwoo:WURTH_748421245
L2 = kwoo:NR6045TXXX
L3 = kwoo:SRR1260-330MCT-ND
L5 = kwoo:MI0805K400R-10
LED4 LED6 LED7 = SparkFun:LED: LEDs Standard schematic elements and footprints for 5mm, 3mm, 1206, and 0603 sized LEDs. 5mm - Spark Fun Electronics SKU : COM-00529 (and others)
Q3 = kwoo:NX3225SA
Q8 Q9 Q13 Q16 = kwoo:DMMT3906W
Q18 = kwoo:DMP266LDM
R1 R2 R7-R9 R11 R12 R21 R22 R24 R43-R45 R47 R49 R50 R53-R59 R61 R62 R69-R72 R83-R88 R93 R94 R99 R105-R109 R112-R115 R119 R121-R126 = resistor:R-US_: RESISTOR, American symbol
R31 R52 = rcl:R-US_: RESISTOR, American symbol
S1-S4 S6 = SparkFun:TAC_SWITCH: Momentary Switch Button commonly used for reset or general input. Spark Fun Electronics SKU : COM-00097
SV1 = kwoo:MA06-2W: PIN HEADER
SV2 = con-lstb:MA03-1: PIN HEADER; OC_FARNELL: unknown; OC_NEWARK: unknown
SV3 = kwoo:MA02-2W
U1 = kwoo:ATMEGA128RF
U2 U6 = kwoo:TC1015
U3 U4 = kwoo:NL27WZ14
U5 U7-U11 = kwoo:TXB0108
U12 = kwoo:74LVC1G11
U14 = SparkFun-Sensors:L3G4200D: L3G4200D Three-axis, digital output gyroscope The L3G4200D is a low-power three-axis angular rate sensor, has a full scale of ±250/±500/±2000 dps and is capable of measuring rates with a user-selectable bandwidth. It includes a sensing element and an IC interface capable of providing the measured angular rate to the external world through a digital interface (I2C/SPI). Package: 4x4x1.1 LGA-16 (LGA16-4x4.PAC)
U15 = SparkFun-Sensors:MAG3110: 3-axis digital (I2C) magnetometer
U16 = SparkFun-Sensors:MMA8452Q: MMA8452Q 3-Axis, 12/8-bit Digital Accelerometer Supply Voltage: 1.6-3.6V Range: +/- 2g, 4g, 8g Interface: I2C, 12-bit and 8-bit ODR: 1.56 Hz - 800 Hz Package: QFN-16 http://cache.freescale.com/files/sensors/doc/data_sheet/MMA8452Q.pdf
U$1 U$35 = kwoo:PCA9306
U$2 U$27 = kwoo:TB6612FNG
U$3 = kwoo:AP1501
U$6 = SparkFun:M04X2
U$7 = rc:ROBOLOGO
U$9 = kwoo:MAX16054
U$10 = kwoo:MIC4680-3.3YM
U$16 = overo:OVERO
U$18 U$20 = SparkFun:V_REG_317: Voltage Regulator Standard LM317 adjustable voltage regulator. AOI (Adjust Output Input). Google 'LM317 Calculator' for easy to use app to get the two resistor values needed. 240/720 for 5V output. 240/390 for 3.3V output. Spark Fun Electronics SKU : COM-00527
U$29 = SparkFun:AVR_SPI_PRG_6: AVR ISP 6 Pin This is the reduced ISP connector for AVR programming. Common on Arduino. This footprint will take up less PCB space and can be used with a 10-pin to 6-pin adapter such as SKU: BOB-08508
U$32 U$34 = SparkFun:LED-TRICOLOR-THROUGHHOLE
X1 = kwoo:MINI-USB-: MINI USB Connector Source: http://www.hirose.co.jp/cataloge_hp/e24000019.pdf; OC_FARNELL: unknown; OC_NEWARK: unknown